# EAGLE schematic battery_module (EAGLE 9.1.1)
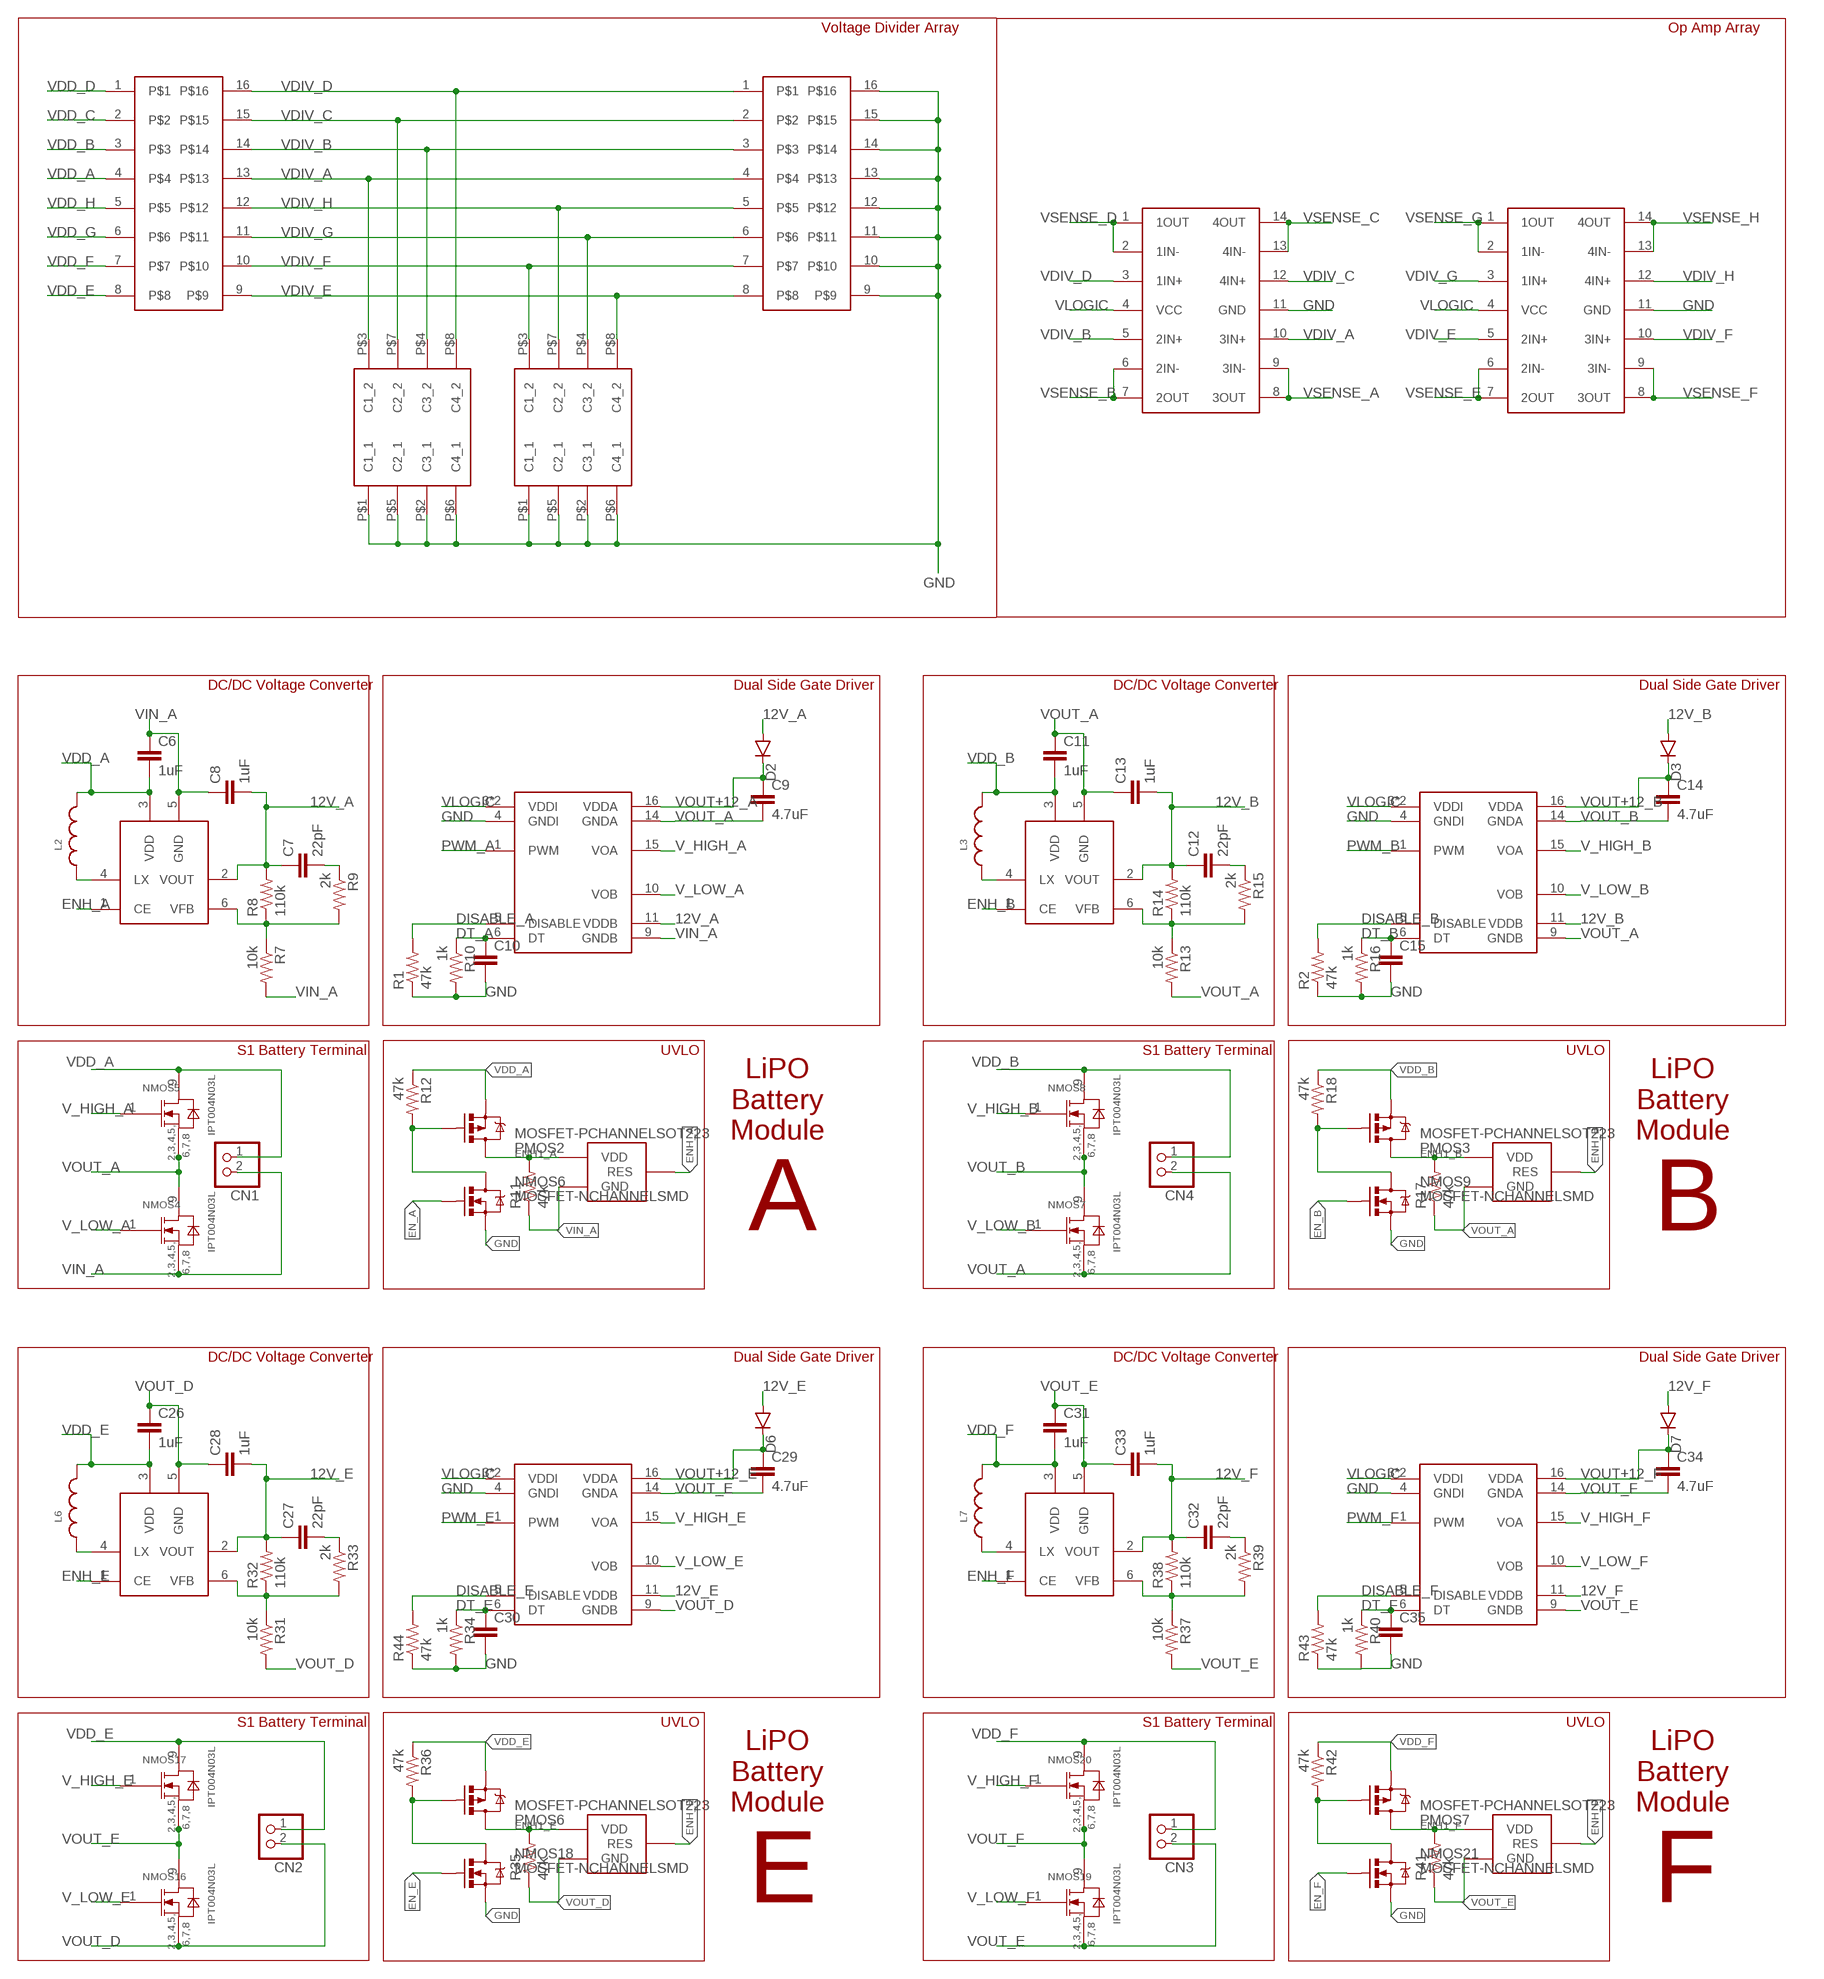
[diagram p0: schematic, sheet 1, part 1 of 2]
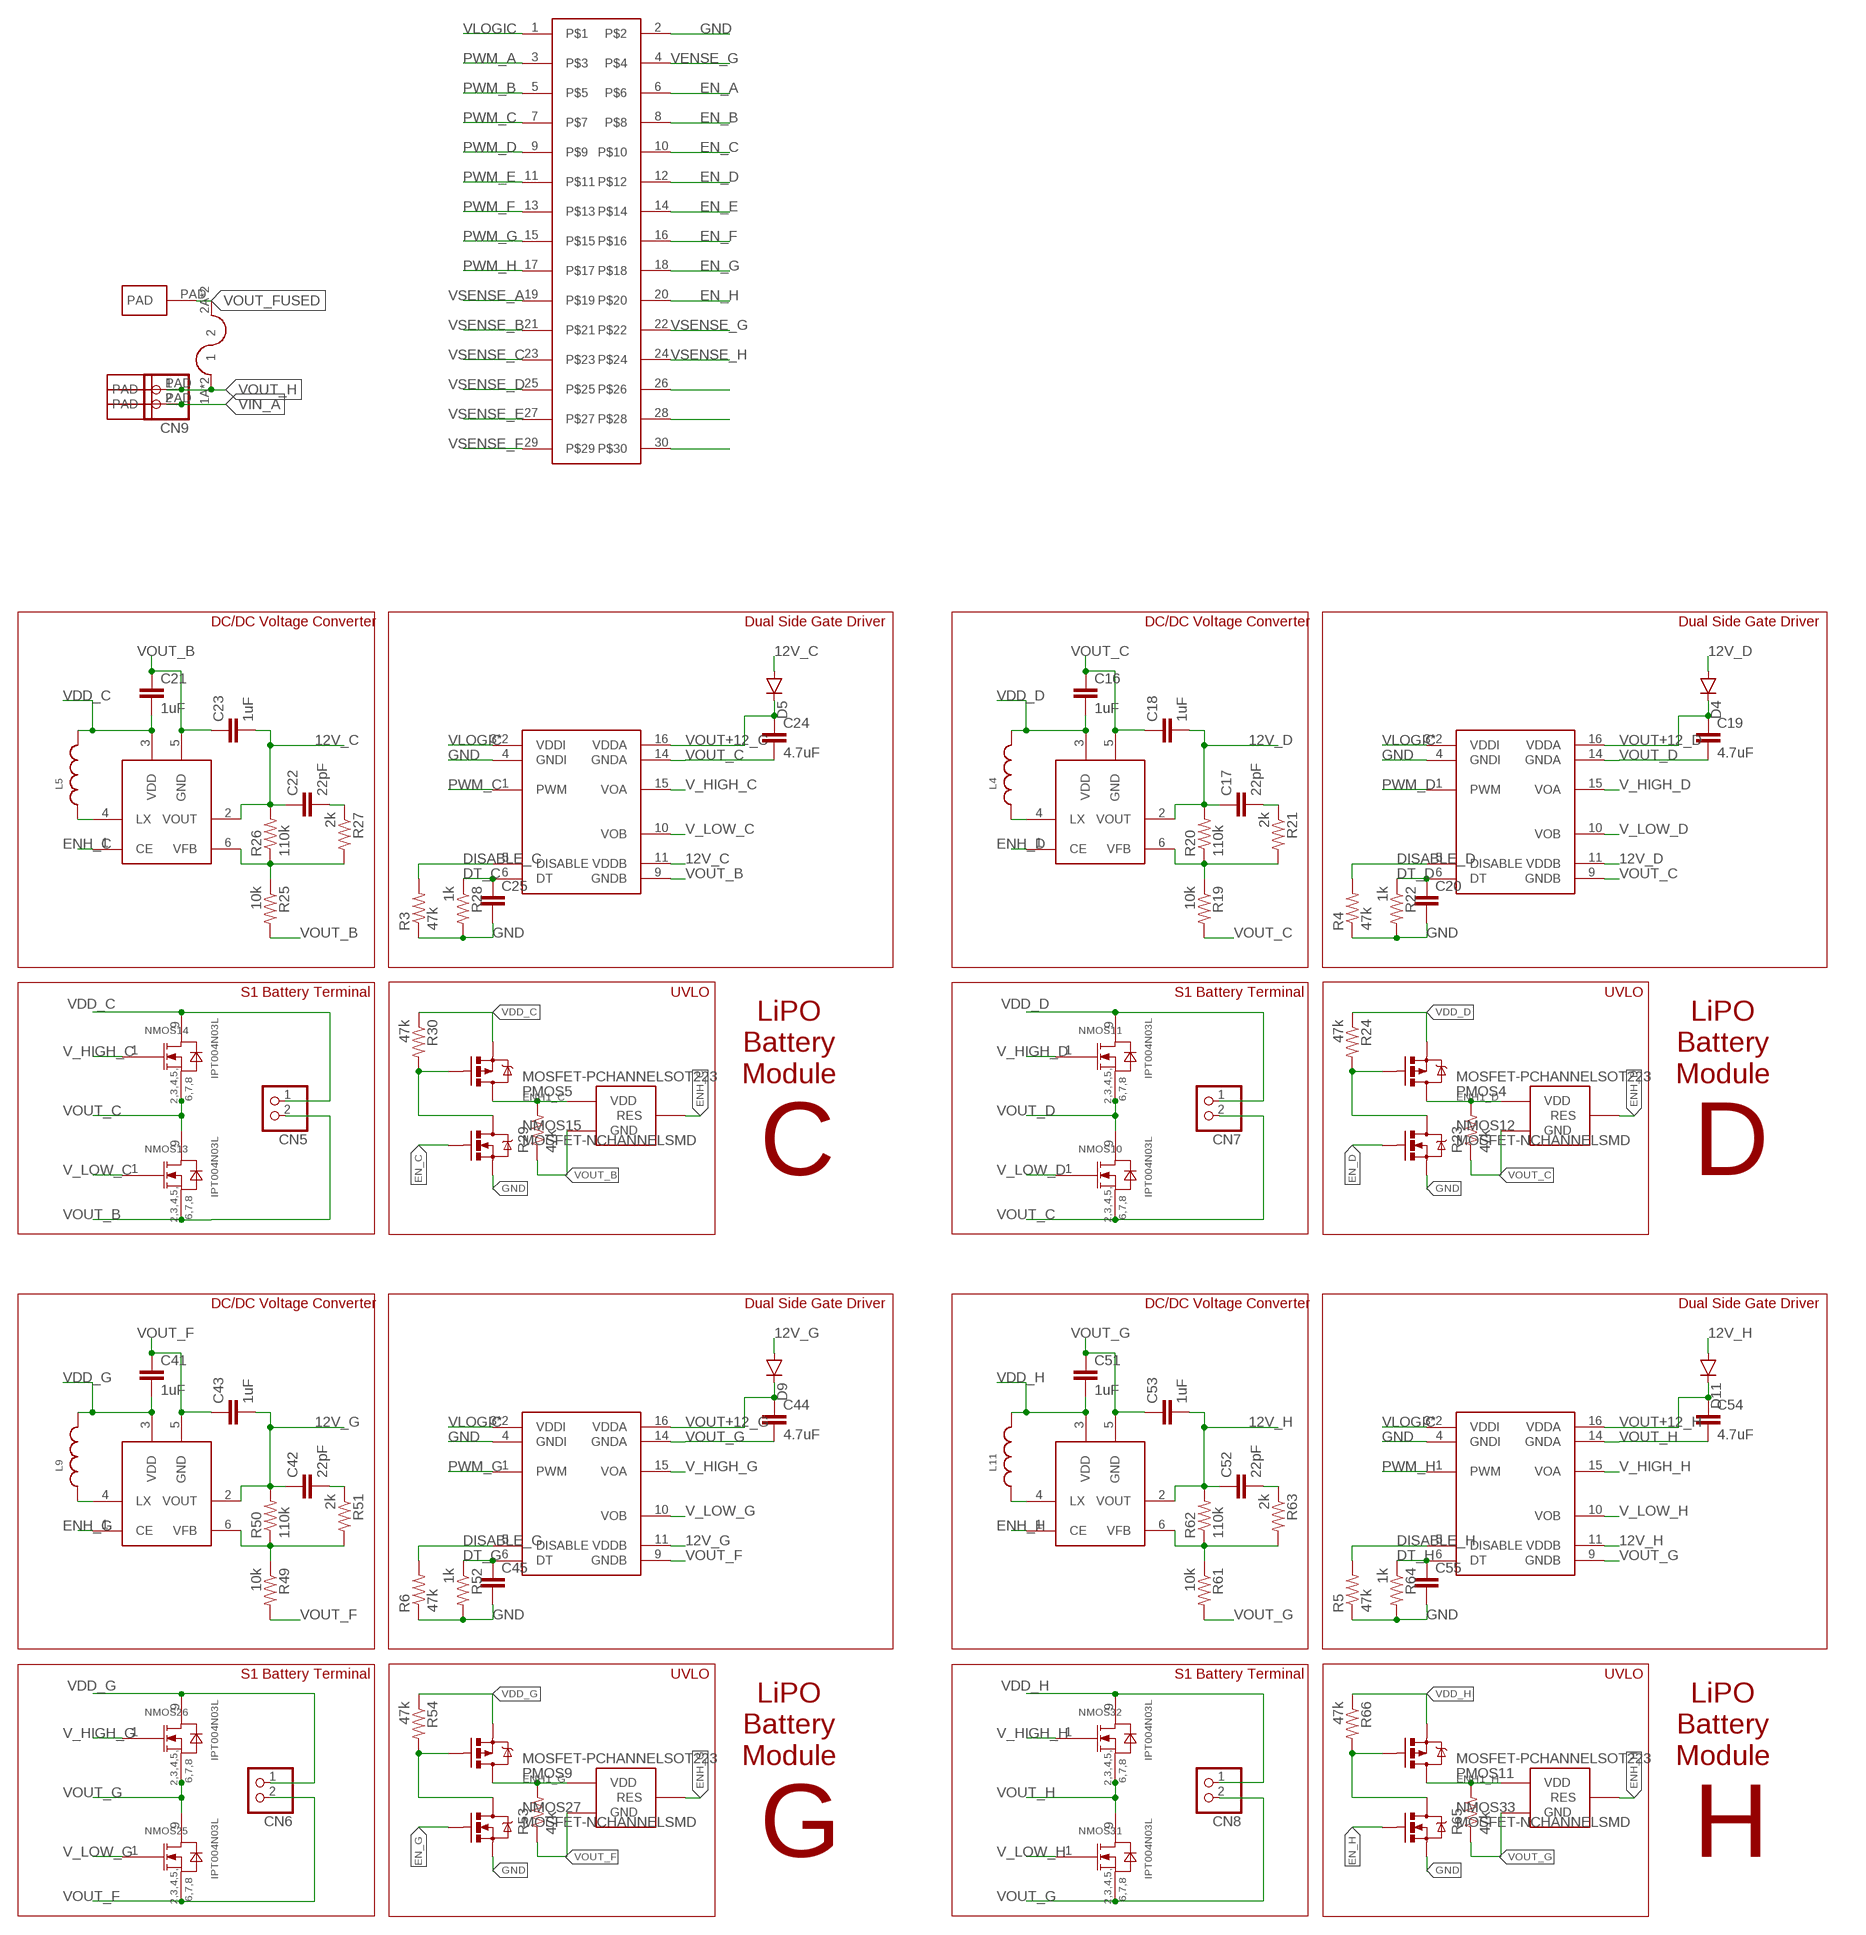
[diagram p1: schematic, sheet 1, part 2 of 2]

## Parts
ARRAY1  47k  EXB-2HV  [1506]
ARRAY2  EXB-2HV  [1506]
C6  1uF  CAP0603-CAP  [0603-CAP]
C7  22pF  CAP0603-CAP  [0603-CAP]
C8  1uF  CAP0603-CAP  [0603-CAP]
C9  4.7uF  CAP0603-CAP  [0603-CAP]
C10  CAP0603-CAP  [0603-CAP]
C11  1uF  CAP0603-CAP  [0603-CAP]
C12  22pF  CAP0603-CAP  [0603-CAP]
C13  1uF  CAP0603-CAP  [0603-CAP]
C14  4.7uF  CAP0603-CAP  [0603-CAP]
C15  CAP0603-CAP  [0603-CAP]
C16  1uF  CAP0603-CAP  [0603-CAP]
C17  22pF  CAP0603-CAP  [0603-CAP]
C18  1uF  CAP0603-CAP  [0603-CAP]
C19  4.7uF  CAP0603-CAP  [0603-CAP]
C20  CAP0603-CAP  [0603-CAP]
C21  1uF  CAP0603-CAP  [0603-CAP]
C22  22pF  CAP0603-CAP  [0603-CAP]
C23  1uF  CAP0603-CAP  [0603-CAP]
C24  4.7uF  CAP0603-CAP  [0603-CAP]
C25  CAP0603-CAP  [0603-CAP]
C26  1uF  CAP0603-CAP  [0603-CAP]
C27  22pF  CAP0603-CAP  [0603-CAP]
C28  1uF  CAP0603-CAP  [0603-CAP]
C29  4.7uF  CAP0603-CAP  [0603-CAP]
C30  CAP0603-CAP  [0603-CAP]
C31  1uF  CAP0603-CAP  [0603-CAP]
C32  22pF  CAP0603-CAP  [0603-CAP]
C33  1uF  CAP0603-CAP  [0603-CAP]
C34  4.7uF  CAP0603-CAP  [0603-CAP]
C35  CAP0603-CAP  [0603-CAP]
C41  1uF  CAP0603-CAP  [0603-CAP]
C42  22pF  CAP0603-CAP  [0603-CAP]
C43  1uF  CAP0603-CAP  [0603-CAP]
C44  4.7uF  CAP0603-CAP  [0603-CAP]
C45  CAP0603-CAP  [0603-CAP]
C51  1uF  CAP0603-CAP  [0603-CAP]
C52  22pF  CAP0603-CAP  [0603-CAP]
C53  1uF  CAP0603-CAP  [0603-CAP]
C54  4.7uF  CAP0603-CAP  [0603-CAP]
C55  CAP0603-CAP  [0603-CAP]
CN1  JST_2PIN-THM  [JST-PH-2-THM]
CN2  JST_2PIN-THM  [JST-PH-2-THM]
CN3  JST_2PIN-THM  [JST-PH-2-THM]
CN4  JST_2PIN-THM  [JST-PH-2-THM]
CN5  JST_2PIN-THM  [JST-PH-2-THM]
CN6  JST_2PIN-THM  [JST-PH-2-THM]
CN7  JST_2PIN-THM  [JST-PH-2-THM]
CN8  JST_2PIN-THM  [JST-PH-2-THM]
CN9  JST_2PIN-THM  [JST-PH-2-THM]
D2  DIODESMB  [SMB-DIODE]
D3  DIODESMB  [SMB-DIODE]
D4  DIODESMB  [SMB-DIODE]
D5  DIODESMB  [SMB-DIODE]
D6  DIODESMB  [SMB-DIODE]
D7  DIODESMB  [SMB-DIODE]
D9  DIODESMB  [SMB-DIODE]
D11  DIODESMB  [SMB-DIODE]
DRIVER2  SI8231SOIC16W  [SOIC16LWB]
DRIVER3  SI8231SOIC16W  [SOIC16LWB]
DRIVER4  SI8231SOIC16W  [SOIC16LWB]
DRIVER5  SI8231SOIC16W  [SOIC16LWB]
DRIVER6  SI8231SOIC16W  [SOIC16LWB]
DRIVER7  SI8231SOIC16W  [SOIC16LWB]
DRIVER9  SI8231SOIC16W  [SOIC16LWB]
DRIVER11  SI8231SOIC16W  [SOIC16LWB]
L2  WE-LQS_4025_74404043220A  [WE-LQS_4025]
L3  WE-LQS_4025_74404043220A  [WE-LQS_4025]
L4  WE-LQS_4025_74404043220A  [WE-LQS_4025]
L5  WE-LQS_4025_74404043220A  [WE-LQS_4025]
L6  WE-LQS_4025_74404043220A  [WE-LQS_4025]
L7  WE-LQS_4025_74404043220A  [WE-LQS_4025]
L9  WE-LQS_4025_74404043220A  [WE-LQS_4025]
L11  WE-LQS_4025_74404043220A  [WE-LQS_4025]
NMOS4  IPT004N03L  [INF-PG-HSOF-8-1-0]
NMOS5  IPT004N03L  [INF-PG-HSOF-8-1-0]
NMOS6  MOSFET-NCHANNELSMD  [SOT23-3]
NMOS7  IPT004N03L  [INF-PG-HSOF-8-1-0]
NMOS8  IPT004N03L  [INF-PG-HSOF-8-1-0]
NMOS9  MOSFET-NCHANNELSMD  [SOT23-3]
NMOS10  IPT004N03L  [INF-PG-HSOF-8-1-0]
NMOS11  IPT004N03L  [INF-PG-HSOF-8-1-0]
NMOS12  MOSFET-NCHANNELSMD  [SOT23-3]
NMOS13  IPT004N03L  [INF-PG-HSOF-8-1-0]
NMOS14  IPT004N03L  [INF-PG-HSOF-8-1-0]
NMOS15  MOSFET-NCHANNELSMD  [SOT23-3]
NMOS16  IPT004N03L  [INF-PG-HSOF-8-1-0]
NMOS17  IPT004N03L  [INF-PG-HSOF-8-1-0]
NMOS18  MOSFET-NCHANNELSMD  [SOT23-3]
NMOS19  IPT004N03L  [INF-PG-HSOF-8-1-0]
NMOS20  IPT004N03L  [INF-PG-HSOF-8-1-0]
NMOS21  MOSFET-NCHANNELSMD  [SOT23-3]
NMOS25  IPT004N03L  [INF-PG-HSOF-8-1-0]
NMOS26  IPT004N03L  [INF-PG-HSOF-8-1-0]
NMOS27  MOSFET-NCHANNELSMD  [SOT23-3]
NMOS31  IPT004N03L  [INF-PG-HSOF-8-1-0]
NMOS32  IPT004N03L  [INF-PG-HSOF-8-1-0]
NMOS33  MOSFET-NCHANNELSMD  [SOT23-3]
PMOS2  MOSFET-PCHANNELSOT223  [SOT223]
PMOS3  MOSFET-PCHANNELSOT223  [SOT223]
PMOS4  MOSFET-PCHANNELSOT223  [SOT223]
PMOS5  MOSFET-PCHANNELSOT223  [SOT223]
PMOS6  MOSFET-PCHANNELSOT223  [SOT223]
PMOS7  MOSFET-PCHANNELSOT223  [SOT223]
PMOS9  MOSFET-PCHANNELSOT223  [SOT223]
PMOS11  MOSFET-PCHANNELSOT223  [SOT223]
R1  47k  RESISTOR0603-RES  [0603-RES]
R2  47k  RESISTOR0603-RES  [0603-RES]
R3  47k  RESISTOR0603-RES  [0603-RES]
R4  47k  RESISTOR0603-RES  [0603-RES]
R5  47k  RESISTOR0603-RES  [0603-RES]
R6  47k  RESISTOR0603-RES  [0603-RES]
R7  10k  RESISTOR0603  [0603-RES]
R8  110k  RESISTOR0603  [0603-RES]
R9  2k  RESISTOR0603  [0603-RES]
R10  1k  RESISTOR0603  [0603-RES]
R11  47k  RESISTOR0603-RES  [0603-RES]
R12  47k  RESISTOR0603-RES  [0603-RES]
R13  10k  RESISTOR0603  [0603-RES]
R14  110k  RESISTOR0603  [0603-RES]
R15  2k  RESISTOR0603  [0603-RES]
R16  1k  RESISTOR0603  [0603-RES]
R17  47k  RESISTOR0603-RES  [0603-RES]
R18  47k  RESISTOR0603-RES  [0603-RES]
R19  10k  RESISTOR0603  [0603-RES]
R20  110k  RESISTOR0603  [0603-RES]
R21  2k  RESISTOR0603  [0603-RES]
R22  1k  RESISTOR0603  [0603-RES]
R23  47k  RESISTOR0603-RES  [0603-RES]
R24  47k  RESISTOR0603-RES  [0603-RES]
R25  10k  RESISTOR0603  [0603-RES]
R26  110k  RESISTOR0603  [0603-RES]
R27  2k  RESISTOR0603  [0603-RES]
R28  1k  RESISTOR0603  [0603-RES]
R29  47k  RESISTOR0603-RES  [0603-RES]
R30  47k  RESISTOR0603-RES  [0603-RES]
R31  10k  RESISTOR0603  [0603-RES]
R32  110k  RESISTOR0603  [0603-RES]
R33  2k  RESISTOR0603  [0603-RES]
R34  1k  RESISTOR0603  [0603-RES]
R35  47k  RESISTOR0603-RES  [0603-RES]
R36  47k  RESISTOR0603-RES  [0603-RES]
R37  10k  RESISTOR0603  [0603-RES]
R38  110k  RESISTOR0603  [0603-RES]
R39  2k  RESISTOR0603  [0603-RES]
R40  1k  RESISTOR0603  [0603-RES]
R41  47k  RESISTOR0603-RES  [0603-RES]
R42  47k  RESISTOR0603-RES  [0603-RES]
R43  47k  RESISTOR0603-RES  [0603-RES]
R44  47k  RESISTOR0603-RES  [0603-RES]
R49  10k  RESISTOR0603  [0603-RES]
R50  110k  RESISTOR0603  [0603-RES]
R51  2k  RESISTOR0603  [0603-RES]
R52  1k  RESISTOR0603  [0603-RES]
R53  47k  RESISTOR0603-RES  [0603-RES]
R54  47k  RESISTOR0603-RES  [0603-RES]
R61  10k  RESISTOR0603  [0603-RES]
R62  110k  RESISTOR0603  [0603-RES]
R63  2k  RESISTOR0603  [0603-RES]
R64  1k  RESISTOR0603  [0603-RES]
R65  47k  RESISTOR0603-RES  [0603-RES]
R66  47k  RESISTOR0603-RES  [0603-RES]
U$1  30_HEADER  [2X15_SHROUDED]
U$2  FUSE  [AUTO_FUSE]
U$10  LM324  [SOIC14]
U$11  CL31  [1206-4XARRAY]
U$12  LM324  [SOIC14]
U$13  CL31  [1206-4XARRAY]
VDETECTOR2  BD49XXK__G  [SOT23-3]
VDETECTOR3  BD49XXK__G  [SOT23-3]
VDETECTOR4  BD49XXK__G  [SOT23-3]
VDETECTOR5  BD49XXK__G  [SOT23-3]
VDETECTOR6  BD49XXK__G  [SOT23-3]
VDETECTOR7  BD49XXK__G  [SOT23-3]
VDETECTOR9  BD49XXK__G  [SOT23-3]
VDETECTOR11  BD49XXK__G  [SOT23-3]
VOUT+  PAD  [PAD]
VOUT-  PAD  [PAD]
VOUT_FUSED  PAD  [PAD]
VREG2  R1200SOT-23-6  [SOT-23-6]
VREG3  R1200SOT-23-6  [SOT-23-6]
VREG4  R1200SOT-23-6  [SOT-23-6]
VREG5  R1200SOT-23-6  [SOT-23-6]
VREG6  R1200SOT-23-6  [SOT-23-6]
VREG7  R1200SOT-23-6  [SOT-23-6]
VREG9  R1200SOT-23-6  [SOT-23-6]
VREG11  R1200SOT-23-6  [SOT-23-6]

## Nets
12V_A: C7.1 C8.2 D2.A DRIVER2.11(VDDB) R8.2 VREG2.2(VOUT)
12V_B: C12.1 C13.2 D3.A DRIVER3.11(VDDB) R14.2 VREG3.2(VOUT)
12V_C: C22.1 C23.2 D5.A DRIVER5.11(VDDB) R26.2 VREG5.2(VOUT)
12V_D: C17.1 C18.2 D4.A DRIVER4.11(VDDB) R20.2 VREG4.2(VOUT)
12V_E: C27.1 C28.2 D6.A DRIVER6.11(VDDB) R32.2 VREG6.2(VOUT)
12V_F: C32.1 C33.2 D7.A DRIVER7.11(VDDB) R38.2 VREG7.2(VOUT)
12V_G: C42.1 C43.2 D9.A DRIVER9.11(VDDB) R50.2 VREG9.2(VOUT)
12V_H: C52.1 C53.2 D11.A DRIVER11.11(VDDB) R62.2 VREG11.2(VOUT)
DISABLE_A: DRIVER2.5(DISABLE) R1.2
DISABLE_B: DRIVER3.5(DISABLE) R2.2
DISABLE_C: DRIVER5.5(DISABLE) R3.2
DISABLE_D: DRIVER4.5(DISABLE) R4.2
DISABLE_E: DRIVER6.5(DISABLE) R44.2
DISABLE_F: DRIVER7.5(DISABLE) R43.2
DISABLE_G: DRIVER9.5(DISABLE) R6.2
DISABLE_H: DRIVER11.5(DISABLE) R5.2
DT_A: C10.1 DRIVER2.6(DT) R10.1
DT_B: C15.1 DRIVER3.6(DT) R16.1
DT_C: C25.1 DRIVER5.6(DT) R28.1
DT_D: C20.1 DRIVER4.6(DT) R22.1
DT_E: C30.1 DRIVER6.6(DT) R34.1
DT_F: C35.1 DRIVER7.6(DT) R40.1
DT_G: C45.1 DRIVER9.6(DT) R52.1
DT_H: C55.1 DRIVER11.6(DT) R64.1
EN_A: NMOS6.1(G) U$1.6
EN_B: NMOS9.1(G) U$1.8
EN_C: NMOS15.1(G) U$1.10
EN_D: NMOS12.1(G) U$1.12
EN_E: NMOS18.1(G) U$1.14
EN_F: NMOS21.1(G) U$1.16
EN_G: NMOS27.1(G) U$1.18
EN_H: NMOS33.1(G) U$1.20
ENH1_A: PMOS2.2(D) PMOS2.4(D) R11.2 VDETECTOR2.3(VDD)
ENH1_B: PMOS3.2(D) PMOS3.4(D) R17.2 VDETECTOR3.3(VDD)
ENH1_C: PMOS5.2(D) PMOS5.4(D) R29.2 VDETECTOR5.3(VDD)
ENH1_D: PMOS4.2(D) PMOS4.4(D) R23.2 VDETECTOR4.3(VDD)
ENH1_E: PMOS6.2(D) PMOS6.4(D) R35.2 VDETECTOR6.3(VDD)
ENH1_F: PMOS7.2(D) PMOS7.4(D) R41.2 VDETECTOR7.3(VDD)
ENH1_G: PMOS9.2(D) PMOS9.4(D) R53.2 VDETECTOR9.3(VDD)
ENH1_H: PMOS11.2(D) PMOS11.4(D) R65.2 VDETECTOR11.3(VDD)
ENH_A: VDETECTOR2.2(RES) VREG2.1(CE)
ENH_B: VDETECTOR3.2(RES) VREG3.1(CE)
ENH_C: VDETECTOR5.2(RES) VREG5.1(CE)
ENH_D: VDETECTOR4.2(RES) VREG4.1(CE)
ENH_E: VDETECTOR6.2(RES) VREG6.1(CE)
ENH_F: VDETECTOR7.2(RES) VREG7.1(CE)
ENH_G: VDETECTOR9.2(RES) VREG9.1(CE)
ENH_H: VDETECTOR11.2(RES) VREG11.1(CE)
GND: ARRAY2.9 ARRAY2.10 ARRAY2.11 ARRAY2.12 ARRAY2.13 ARRAY2.14 ARRAY2.15 ARRAY2.16 C10.2 C15.2 C20.2 C25.2 C30.2 C35.2 C45.2 C55.2 DRIVER2.4(GNDI) DRIVER3.4(GNDI) DRIVER4.4(GNDI) DRIVER5.4(GNDI) DRIVER6.4(GNDI) DRIVER7.4(GNDI) DRIVER9.4(GNDI) DRIVER11.4(GNDI) NMOS6.2(S) NMOS9.2(S) NMOS12.2(S) NMOS15.2(S) NMOS18.2(S) NMOS21.2(S) NMOS27.2(S) NMOS33.2(S) R1.1 R2.1 R3.1 R4.1 R5.1 R6.1 R10.2 R16.2 R22.2 R28.2 R34.2 R40.2 R43.1 R44.1 R52.2 R64.2 U$1.2 U$10.11(GND) U$11.P$1(C1_1) U$11.P$2(C3_1) U$11.P$5(C2_1) U$11.P$6(C4_1) U$12.11(GND) U$13.P$1(C1_1) U$13.P$2(C3_1) U$13.P$5(C2_1) U$13.P$6(C4_1)
N$2: R7.1 R8.1 R9.2 VREG2.6(VFB)
N$4: L2.1 VREG2.4(LX)
N$6: C7.2 R9.1
N$7: NMOS6.3(D) PMOS2.1(G) R12.2
N$8: R13.1 R14.1 R15.2 VREG3.6(VFB)
N$9: L3.1 VREG3.4(LX)
N$10: C12.2 R15.1
N$11: NMOS9.3(D) PMOS3.1(G) R18.2
N$12: R19.1 R20.1 R21.2 VREG4.6(VFB)
N$13: L4.1 VREG4.4(LX)
N$14: C17.2 R21.1
N$15: NMOS12.3(D) PMOS4.1(G) R24.2
N$16: R25.1 R26.1 R27.2 VREG5.6(VFB)
N$17: L5.1 VREG5.4(LX)
N$18: C22.2 R27.1
N$19: NMOS15.3(D) PMOS5.1(G) R30.2
N$20: R31.1 R32.1 R33.2 VREG6.6(VFB)
N$21: L6.1 VREG6.4(LX)
N$22: C27.2 R33.1
N$23: NMOS18.3(D) PMOS6.1(G) R36.2
N$24: R37.1 R38.1 R39.2 VREG7.6(VFB)
N$25: L7.1 VREG7.4(LX)
N$27: C32.2 R39.1
N$28: NMOS21.3(D) PMOS7.1(G) R42.2
N$33: R49.1 R50.1 R51.2 VREG9.6(VFB)
N$34: L9.1 VREG9.4(LX)
N$35: C42.2 R51.1
N$36: NMOS27.3(D) PMOS9.1(G) R54.2
N$41: R61.1 R62.1 R63.2 VREG11.6(VFB)
N$42: L11.1 VREG11.4(LX)
N$43: C52.2 R63.1
N$44: NMOS33.3(D) PMOS11.1(G) R66.2
N$60: U$1.28
N$61: U$1.26
N$62: U$1.30
PWM_A: DRIVER2.1(PWM) U$1.3
PWM_B: DRIVER3.1(PWM) U$1.5
PWM_C: DRIVER5.1(PWM) U$1.7
PWM_D: DRIVER4.1(PWM) U$1.9
PWM_E: DRIVER6.1(PWM) U$1.11
PWM_F: DRIVER7.1(PWM) U$1.13
PWM_G: DRIVER9.1(PWM) U$1.15
PWM_H: DRIVER11.1(PWM) U$1.17
V_HIGH_A: DRIVER2.15(VOA) NMOS5.1
V_HIGH_B: DRIVER3.15(VOA) NMOS8.1
V_HIGH_C: DRIVER5.15(VOA) NMOS14.1
V_HIGH_D: DRIVER4.15(VOA) NMOS11.1
V_HIGH_E: DRIVER6.15(VOA) NMOS17.1
V_HIGH_F: DRIVER7.15(VOA) NMOS20.1
V_HIGH_G: DRIVER9.15(VOA) NMOS26.1
V_HIGH_H: DRIVER11.15(VOA) NMOS32.1
V_LOW_A: DRIVER2.10(VOB) NMOS4.1
V_LOW_B: DRIVER3.10(VOB) NMOS7.1
V_LOW_C: DRIVER5.10(VOB) NMOS13.1
V_LOW_D: DRIVER4.10(VOB) NMOS10.1
V_LOW_E: DRIVER6.10(VOB) NMOS16.1
V_LOW_F: DRIVER7.10(VOB) NMOS19.1
V_LOW_G: DRIVER9.10(VOB) NMOS25.1
V_LOW_H: DRIVER11.10(VOB) NMOS31.1
VDD_A: ARRAY1.4 C6.2 CN1.1 L2.2 NMOS5.9 PMOS2.3(S) R12.1 VREG2.3(VDD)
VDD_B: ARRAY1.3 C11.2 CN4.1 L3.2 NMOS8.9 PMOS3.3(S) R18.1 VREG3.3(VDD)
VDD_C: ARRAY1.2 C21.2 CN5.1 L5.2 NMOS14.9 PMOS5.3(S) R30.1 VREG5.3(VDD)
VDD_D: ARRAY1.1 C16.2 CN7.1 L4.2 NMOS11.9 PMOS4.3(S) R24.1 VREG4.3(VDD)
VDD_E: ARRAY1.8 C26.2 CN2.1 L6.2 NMOS17.9 PMOS6.3(S) R36.1 VREG6.3(VDD)
VDD_F: ARRAY1.7 C31.2 CN3.1 L7.2 NMOS20.9 PMOS7.3(S) R42.1 VREG7.3(VDD)
VDD_G: ARRAY1.6 C41.2 CN6.1 L9.2 NMOS26.9 PMOS9.3(S) R54.1 VREG9.3(VDD)
VDD_H: ARRAY1.5 C51.2 CN8.1 L11.2 NMOS32.9 PMOS11.3(S) R66.1 VREG11.3(VDD)
VDIV_A: ARRAY1.13 ARRAY2.4 U$11.P$3(C1_2) U$12.10(3IN+)
VDIV_B: ARRAY1.14 ARRAY2.3 U$11.P$4(C3_2) U$12.5(2IN+)
VDIV_C: ARRAY1.15 ARRAY2.2 U$11.P$7(C2_2) U$12.12(4IN+)
VDIV_D: ARRAY1.16 ARRAY2.1 U$11.P$8(C4_2) U$12.3(1IN+)
VDIV_E: ARRAY1.9 ARRAY2.8 U$10.5(2IN+) U$13.P$8(C4_2)
VDIV_F: ARRAY1.10 ARRAY2.7 U$10.10(3IN+) U$13.P$3(C1_2)
VDIV_G: ARRAY1.11 ARRAY2.6 U$10.3(1IN+) U$13.P$4(C3_2)
VDIV_H: ARRAY1.12 ARRAY2.5 U$10.12(4IN+) U$13.P$7(C2_2)
VENSE_G: U$1.4
VIN_A: C6.1 C8.1 CN1.2 CN9.2 DRIVER2.9(GNDB) NMOS4.2 NMOS4.3 NMOS4.4 NMOS4.5 NMOS4.6 NMOS4.7 NMOS4.8 R7.2 R11.1 VDETECTOR2.1(GND) VOUT-.PAD VREG2.5(GND)
VLOGIC: DRIVER2.3(VDDI) DRIVER2.8(VDDI) DRIVER3.3(VDDI) DRIVER3.8(VDDI) DRIVER4.3(VDDI) DRIVER4.8(VDDI) DRIVER5.3(VDDI) DRIVER5.8(VDDI) DRIVER6.3(VDDI) DRIVER6.8(VDDI) DRIVER7.3(VDDI) DRIVER7.8(VDDI) DRIVER9.3(VDDI) DRIVER9.8(VDDI) DRIVER11.3(VDDI) DRIVER11.8(VDDI) U$1.1 U$10.4(VCC) U$12.4(VCC)
VOUT+12_A: C9.1 D2.C DRIVER2.16(VDDA)
VOUT+12_B: C14.1 D3.C DRIVER3.16(VDDA)
VOUT+12_C: C24.1 D5.C DRIVER5.16(VDDA)
VOUT+12_D: C19.1 D4.C DRIVER4.16(VDDA)
VOUT+12_E: C29.1 D6.C DRIVER6.16(VDDA)
VOUT+12_F: C34.1 D7.C DRIVER7.16(VDDA)
VOUT+12_G: C44.1 D9.C DRIVER9.16(VDDA)
VOUT+12_H: C54.1 D11.C DRIVER11.16(VDDA)
VOUT_A: C9.2 C11.1 C13.1 CN4.2 DRIVER2.14(GNDA) DRIVER3.9(GNDB) NMOS4.9 NMOS5.2 NMOS5.3 NMOS5.4 NMOS5.5 NMOS5.6 NMOS5.7 NMOS5.8 NMOS7.2 NMOS7.3 NMOS7.4 NMOS7.5 NMOS7.6 NMOS7.7 NMOS7.8 R13.2 R17.1 VDETECTOR3.1(GND) VREG3.5(GND)
VOUT_B: C14.2 C21.1 C23.1 CN5.2 DRIVER3.14(GNDA) DRIVER5.9(GNDB) NMOS7.9 NMOS8.2 NMOS8.3 NMOS8.4 NMOS8.5 NMOS8.6 NMOS8.7 NMOS8.8 NMOS13.2 NMOS13.3 NMOS13.4 NMOS13.5 NMOS13.6 NMOS13.7 NMOS13.8 R25.2 R29.1 VDETECTOR5.1(GND) VREG5.5(GND)
VOUT_C: C16.1 C18.1 C24.2 CN7.2 DRIVER4.9(GNDB) DRIVER5.14(GNDA) NMOS10.2 NMOS10.3 NMOS10.4 NMOS10.5 NMOS10.6 NMOS10.7 NMOS10.8 NMOS13.9 NMOS14.2 NMOS14.3 NMOS14.4 NMOS14.5 NMOS14.6 NMOS14.7 NMOS14.8 R19.2 R23.1 VDETECTOR4.1(GND) VREG4.5(GND)
VOUT_D: C19.2 C26.1 C28.1 CN2.2 DRIVER4.14(GNDA) DRIVER6.9(GNDB) NMOS10.9 NMOS11.2 NMOS11.3 NMOS11.4 NMOS11.5 NMOS11.6 NMOS11.7 NMOS11.8 NMOS16.2 NMOS16.3 NMOS16.4 NMOS16.5 NMOS16.6 NMOS16.7 NMOS16.8 R31.2 R35.1 VDETECTOR6.1(GND) VREG6.5(GND)
VOUT_E: C29.2 C31.1 C33.1 CN3.2 DRIVER6.14(GNDA) DRIVER7.9(GNDB) NMOS16.9 NMOS17.2 NMOS17.3 NMOS17.4 NMOS17.5 NMOS17.6 NMOS17.7 NMOS17.8 NMOS19.2 NMOS19.3 NMOS19.4 NMOS19.5 NMOS19.6 NMOS19.7 NMOS19.8 R37.2 R41.1 VDETECTOR7.1(GND) VREG7.5(GND)
VOUT_F: C34.2 C41.1 C43.1 CN6.2 DRIVER7.14(GNDA) DRIVER9.9(GNDB) NMOS19.9 NMOS20.2 NMOS20.3 NMOS20.4 NMOS20.5 NMOS20.6 NMOS20.7 NMOS20.8 NMOS25.2 NMOS25.3 NMOS25.4 NMOS25.5 NMOS25.6 NMOS25.7 NMOS25.8 R49.2 R53.1 VDETECTOR9.1(GND) VREG9.5(GND)
VOUT_FUSED: U$2.2A U$2.2B VOUT_FUSED.PAD
VOUT_G: C44.2 C51.1 C53.1 CN8.2 DRIVER9.14(GNDA) DRIVER11.9(GNDB) NMOS25.9 NMOS26.2 NMOS26.3 NMOS26.4 NMOS26.5 NMOS26.6 NMOS26.7 NMOS26.8 NMOS31.2 NMOS31.3 NMOS31.4 NMOS31.5 NMOS31.6 NMOS31.7 NMOS31.8 R61.2 R65.1 VDETECTOR11.1(GND) VREG11.5(GND)
VOUT_H: C54.2 CN9.1 DRIVER11.14(GNDA) NMOS31.9 NMOS32.2 NMOS32.3 NMOS32.4 NMOS32.5 NMOS32.6 NMOS32.7 NMOS32.8 U$2.1A U$2.1B VOUT+.PAD
VSENSE_A: U$1.19 U$12.8(3OUT) U$12.9(3IN-)
VSENSE_B: U$1.21 U$12.6(2IN-) U$12.7(2OUT)
VSENSE_C: U$1.23 U$12.13(4IN-) U$12.14(4OUT)
VSENSE_D: U$1.25 U$12.1(1OUT) U$12.2(1IN-)
VSENSE_E: U$1.27 U$10.6(2IN-) U$10.7(2OUT)
VSENSE_F: U$1.29 U$10.8(3OUT) U$10.9(3IN-)
VSENSE_G: U$1.22 U$10.1(1OUT) U$10.2(1IN-)
VSENSE_H: U$1.24 U$10.13(4IN-) U$10.14(4OUT)

## Notes on the sheet
- Voltage Divider Array | Op Amp Array
- DC/DC Voltage Converter | Dual Side Gate Driver | DC/DC Voltage Converter | Dual Side Gate Driver | DC/DC Voltage Converter | Dual Side Gate Driver | DC/DC Voltage Converter | Dual Side Gate Driver
- S1 Battery Terminal | UVLO | S1 Battery Terminal | UVLO | S1 Battery Terminal | UVLO | S1 Battery Terminal | UVLO
- LiPO
  Battery
  Module
- LiPO
  Battery
  Module
- LiPO
  Battery
  Module
- LiPO
  Battery
  Module
- A | B | C | D
- DC/DC Voltage Converter | Dual Side Gate Driver | DC/DC Voltage Converter | Dual Side Gate Driver | DC/DC Voltage Converter | Dual Side Gate Driver | DC/DC Voltage Converter | Dual Side Gate Driver
- S1 Battery Terminal | UVLO | S1 Battery Terminal | UVLO | S1 Battery Terminal | UVLO | S1 Battery Terminal | UVLO
- LiPO
  Battery
  Module
- LiPO
  Battery
  Module
- LiPO
  Battery
  Module
- LiPO
  Battery
  Module
- E | F | G | H

## Library data of the parts
ARRAY1 ARRAY2 = Custom_old:EXB-2HV
C6-C8 C11-C13 C16-C18 C21-C23 C26-C28 C31-C33 C41-C43 C51-C53 = SparkFun-Capacitors:CAP: Capacitor Standard 0603 ceramic capacitor, and 0.1" leaded capacitor.
C9 C10 C14 C15 C19 C20 C24 C25 C29 C30 C34 C35 C44 C45 C54 C55 = SparkFun-Passives:CAP: Capacitor Standard 0603 ceramic capacitor, and 0.1" leaded capacitor.
CN1-CN9 = adafruit:JST_2PIN: JST 2-Pin Connectors of various flavors SMT-RA (S2B-PH-SM4) 4UConnector #17311 SMT (B2B-PH-SM4) THM-RA (S2B-PH) THM (B2B-PH)
D2-D7 D9 D11 = SparkFun-DiscreteSemi:DIODE: Diode These are standard reverse protection diodes and small signal diodes. SMA package can handle up to about 1A. SOD-323 can handle about 200mA. What the SOD-323 package when ordering, there are some mfgs out there that are 5-pin packages.; PROD_ID: DIO-09646
DRIVER2-DRIVER7 DRIVER9 DRIVER11 = Custom_old:SI8231
L2-L7 L9 L11 = PowerMagnetics (rev18e):WE-LQS_4025: SMD Shielded Tiny Power Inductor Characteristics Tiny Power Inductor design 1.7 times more current in comparison with unshielded versions Robust design & high durability Low RDC Magnetically shielded with magnetic glue reducing buzz noise in ultra-low levels Operating Temperature: –40 °C to +125 °C Applications Integrated DC/DC Converters Switching controllers which required high efficiency Portable power (Smartphones, digital cameras, Tablets, etc.) Embedded laptops and PCs Big sizes (5040, 60xx, 8040) used for shock-proof circuits <http://katalog.we-online.de/media/images/v2/Family_WE-LQS.jpg> Details see: http://katalog.we-online.de/en/pbs/WE-LQS Created by Dan Xu 2014-05-21 2014 (C) Wurth Elektronik; WE-NUMBER: 74404043220A/22uH
NMOS4 NMOS5 NMOS7 NMOS8 NMOS10 NMOS11 NMOS13 NMOS14 NMOS16 NMOS17 NMOS19 NMOS20 NMOS25 NMOS26 NMOS31 NMOS32 = IPT004N03L:IPT004N03L: IPT004N03L OptiMOS N-Channel Power-Transistor INF-PG-HSOF-8-1-0
NMOS6 NMOS9 NMOS12 NMOS15 NMOS18 NMOS21 NMOS27 NMOS33 = Custom_old:MOSFET-NCHANNEL: Generic NMOS footprint
PMOS2-PMOS7 PMOS9 PMOS11 = Custom_old:MOSFET-PCHANNEL: Generic PMOSFET
R1-R6 R11 R12 R17 R18 R23 R24 R29 R30 R35 R36 R41-R44 R53 R54 R65 R66 = SparkFun-Passives:RESISTOR: Resistor Basic schematic elements and footprints for 0603, 1206, and PTH resistors.
R7-R10 R13-R16 R19-R22 R25-R28 R31-R34 R37-R40 R49-R52 R61-R64 = SparkFun-Resistors:RESISTOR: Resistor Basic schematic elements and footprints for 0603, 1206, and PTH resistors.
U$1 = Custom_old:30_HEADER
U$2 = Custom_old:FUSE
U$10 U$12 = Custom_old:LM324
U$11 U$13 = Custom_old:CL31
VDETECTOR2-VDETECTOR7 VDETECTOR9 VDETECTOR11 = Custom_old:BD49XX
VOUT+ VOUT- VOUT_FUSED = Custom_old:PAD
VREG2-VREG7 VREG9 VREG11 = Custom_old:R1200

## Module BATTERYMODULE
Ports: 

### Library data of the parts